# EAGLE design usb (EAGLE 6.4)
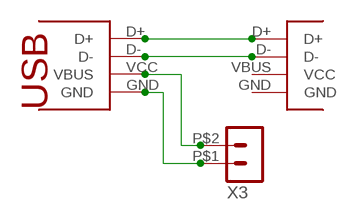
[diagram p0: schematic, sheet 1]

## Parts
U$1  USB-A_FEM  [USB-A-S]
U$2  USB-A-PLUG  [USB-A-H]
X3  HEADER_POS2_43045-0206  [43045-0206]

## Nets
D+: U$1.D+ U$2.D+
D-: U$1.D- U$2.D-
GND [power]: U$1.GND X3.P$1
VCC [power]: U$1.VCC(VBUS) X3.P$2
Unconnected: U$2.GND U$2.VBUS(VCC)

## Library data of the parts
U$1 = ngohara_parts:USB-A_FEM: http://www.digikey.com/product-detail/en/292303-1/A31726-ND/773786
U$2 = ngohara_parts:USB-A-PLUG
X3 = con-molex-micro-fit-3_0:HEADER_POS2_?: Molex - Micro-Fit 3.0 Series connector, 3.00mm (0.118") pitch header, 2 positions.

## Net classes
0 default: width 0.381 mm, drill 0.254 mm, clearance 0.254 mm
1 power: width 0.61 mm, drill 0.508 mm, clearance 0.508 mm

## Board
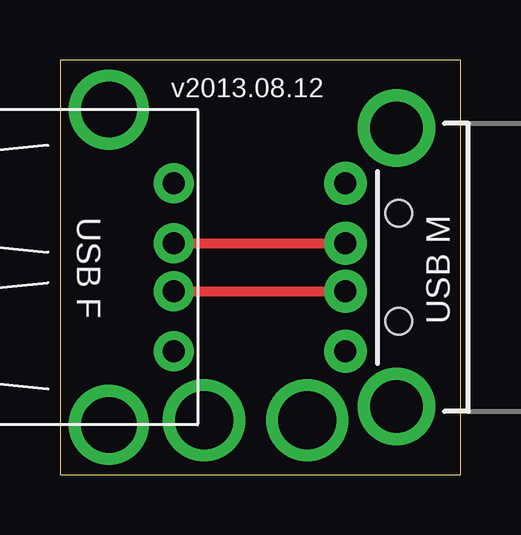
[diagram p1: board, top side]
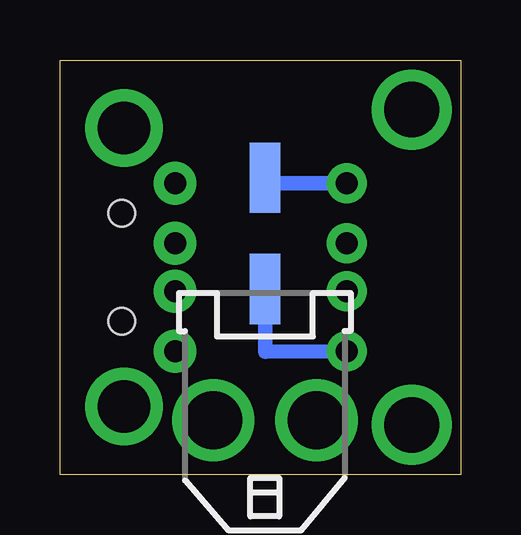
[diagram p2: board, bottom side, seen from below]

Size 16.69 x 17.27 mm. Coordinates in mm from the lower left corner, seen from the top.
Outline: 0,0 16.69,0 16.69,17.27 0,17.27 0,0
Copper layers (1*16): Top 0.035mm / dielectric 1.5mm / Bottom 0.035mm
Design rules "SparkFun": minimum track width 8mil, minimum drill 20mil, track to track 8mil, track to pad 8mil, pad to pad 8mil, via to via 8mil, smd to smd 8mil, copper to edge 10mil, drill to drill 8mil, minimum pad ring 12mil, minimum via ring 10mil, stop-mask expansion 4mil, vias tented up to drill 25mil, thermal gap 10mil

### Footprints (pad centres in the part's own frame; a part is rotated, then mirrored left to right if it is on the bottom)
USB-A-S = drill 0.914 pad 1.676: D+ 2.71,-1; D- 2.71,1; GND 2.71,-3.5; VCC 2.71,3.5 | drill 2.311: P$5 0,-6.566; P$6 0,6.566
USB-A-H = drill 0.914 pad 1.778: D+ 2.13,1; D- 2.13,-1; GND 2.13,3.5; VBUS 2.13,-3.5 | drill 2.2: GND2 0,-5.8; GND3 0,5.8 | hole 1.1: -0.1,2.25; -0.1,-2.25
43045-0206 = smd 1.27 x 2.92: P$1 0,5.47; P$2 0,10.1 | drill 2.41: P$3 -2.15,0; P$4 2.15,0

### Placement (x,y rotation side)
U$1  2.03,8.64 0 top
U$2  14.02,8.64 180 top
X3  8.15,2.26 0 bottom

### Tracks (layer width: path | path; a pad name or v marks a point on that pad's centre or on a via)
D+
  Top 0.406: U$1.D+ U$2.D+
D-
  Top 0.406: U$1.D- U$2.D-
GND
  Bottom 0.61: U$1.GND 8.13,5.11 X3.P$1
VCC
  Bottom 0.61: U$1.VCC 7.77,12.14 X3.P$2

### Text on the board
_tsilk: v2013.08.12 | USB F | USB M